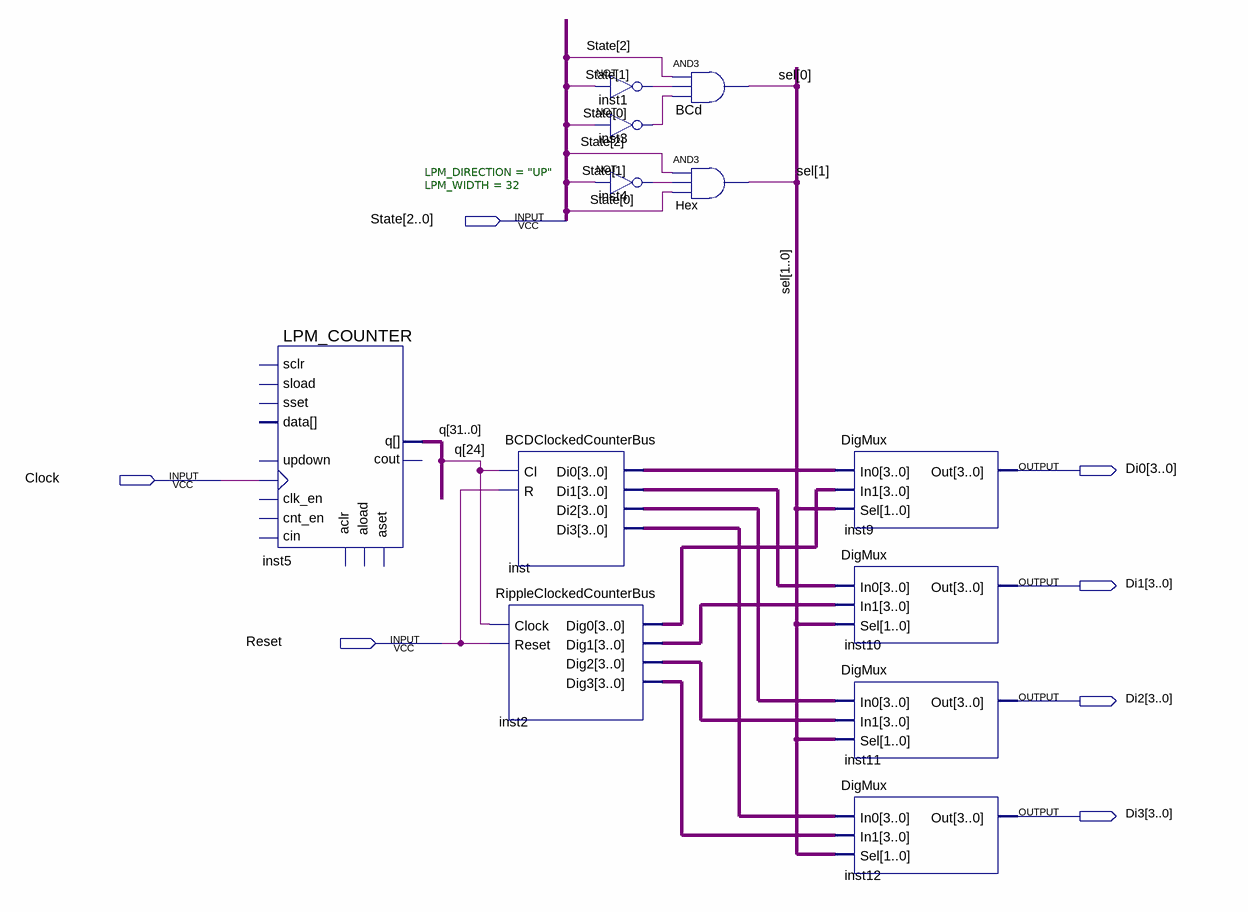
[diagram p0: schematic sheet]
// Quartus schematic CounterSelecter.bdf as structural Verilog: 12 symbols, 7 pins
module CounterSelecter (
  input  [2:0] State,
  input  Clock,
  input  Reset,
  output [3:0] Di0,
  output [3:0] Di1,
  output [3:0] Di2,
  output [3:0] Di3
);

  wire inst1_out, inst3_out, inst4_out;
  wire [1:0] sel;
  wire [3:0] inst2_dig0, inst2_dig1, inst2_dig2, inst2_dig3, inst_di0, inst_di1, inst_di2, inst_di3;
  wire [31:0] q;

  LPM_COUNTER #(.LPM_DIRECTION("UP"), .LPM_WIDTH(32)) inst5 (
    .clock(Clock), .q(q));  // open: sload, data, clk_en, aload, aclr, aset, cin, sset, updown, cnt_en, sclr, cout
  BCDClockedCounterBus inst (.Cl(q[24]), .R(Reset), .Di0(inst_di0), .Di1(inst_di1), .Di2(inst_di2), .Di3(inst_di3));
  RippleClockedCounterBus inst2 (
    .Clock(q[24]), .Reset(Reset), .Dig0(inst2_dig0), .Dig1(inst2_dig1), .Dig2(inst2_dig2), .Dig3(inst2_dig3));
  not inst1 (inst1_out, State[1]);
  not inst3 (inst3_out, State[0]);
  not inst4 (inst4_out, State[1]);
  and BCd (sel[0], State[2], inst1_out, inst3_out);
  and Hex (sel[1], State[2], inst4_out, State[0]);
  DigMux inst9 (.In0(inst_di0), .In1(inst2_dig0), .Sel(sel), .Out(Di0));
  DigMux inst10 (.In0(inst_di1), .In1(inst2_dig1), .Sel(sel), .Out(Di1));
  DigMux inst11 (.In0(inst_di2), .In1(inst2_dig2), .Sel(sel), .Out(Di2));
  DigMux inst12 (.In0(inst_di3), .In1(inst2_dig3), .Sel(sel), .Out(Di3));
endmodule
